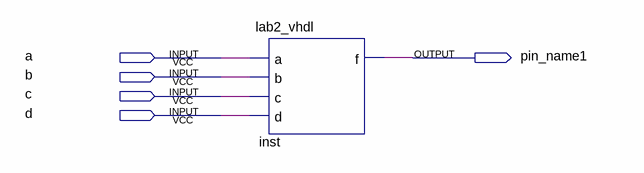
[diagram p0: schematic sheet]
// Quartus schematic Lab 2.bdf as structural Verilog: 1 symbols, 5 pins
module \Lab_2  (
  input  a,
  input  b,
  input  c,
  input  d,
  output pin_name1
);

  lab2_vhdl inst (.a(a), .b(b), .c(c), .d(d), .f(pin_name1));
endmodule
